# EAGLE schematic address_decoder_v1 (EAGLE 9.3.1)
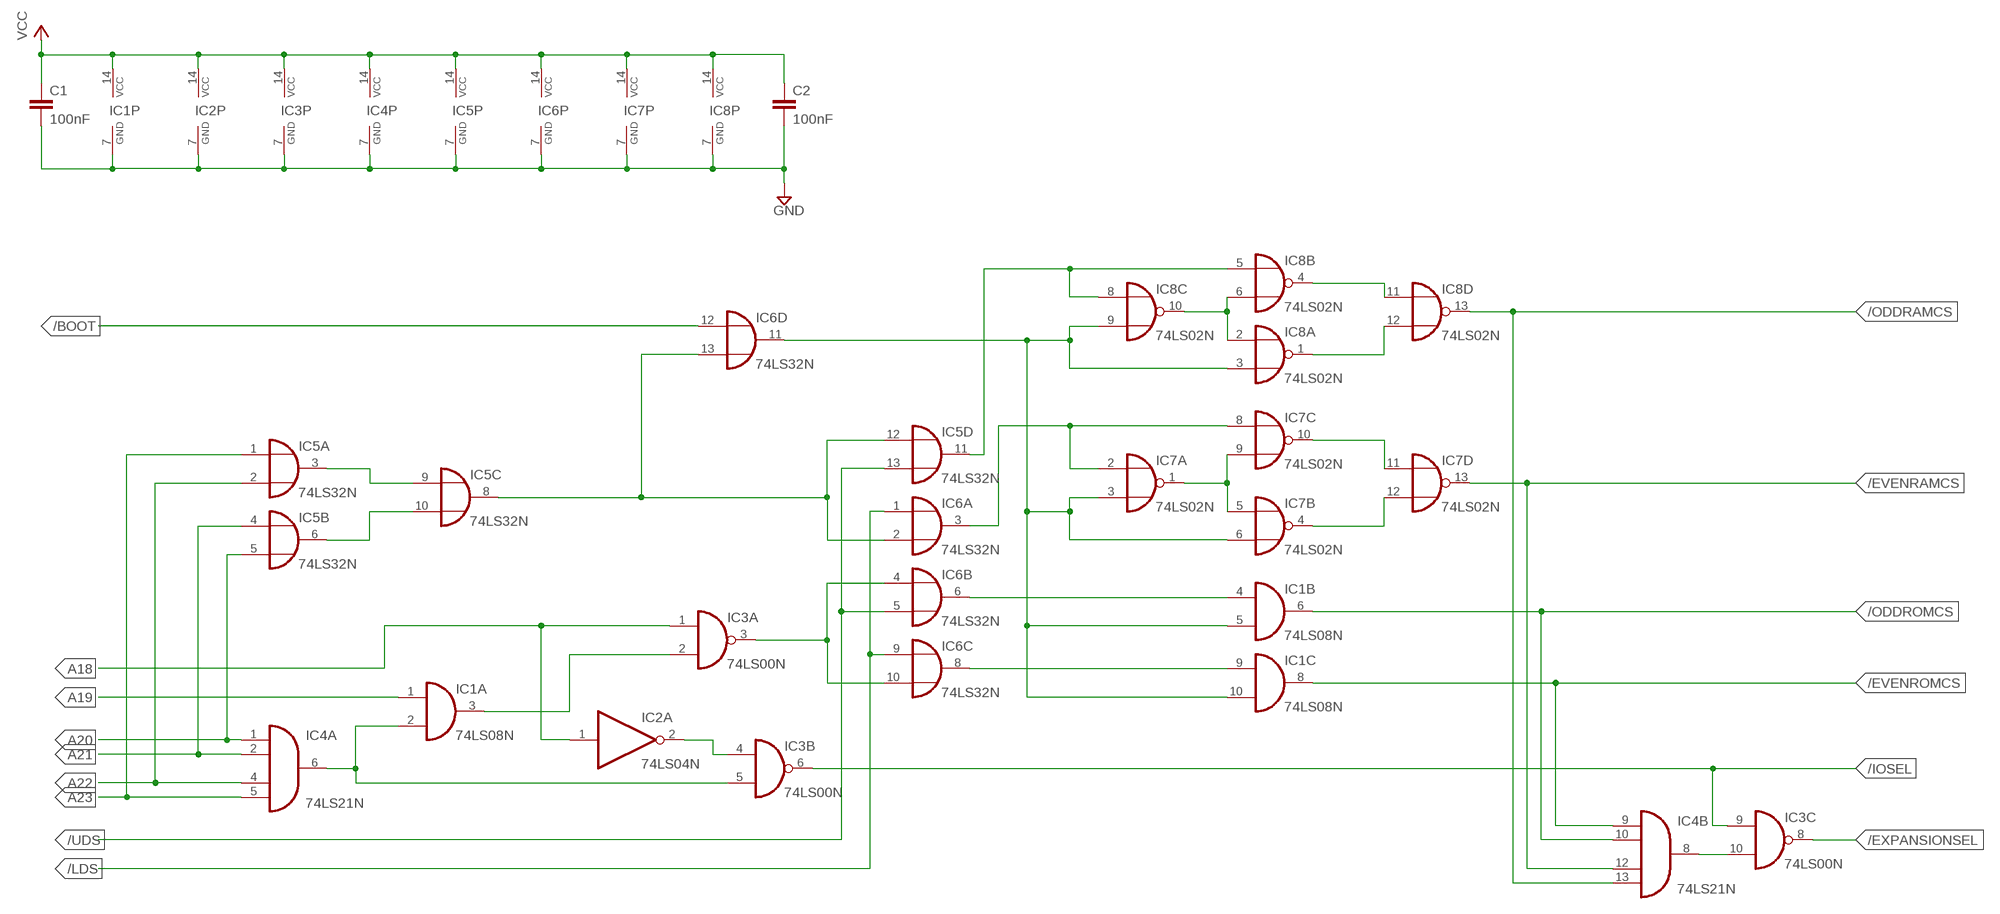
[diagram p0: schematic, sheet 1]

## Parts
C1  100nF  C-EU025-024X044  [C025-024X044]
C2  100nF  C-EU025-024X044  [C025-024X044]
IC1  74LS08N  [DIL14]
IC2  74LS04N  [DIL14]
IC3  74LS00N  [DIL14]
IC4  74LS21N  [DIL14]
IC5  74LS32N  [DIL14]
IC6  74LS32N  [DIL14]
IC7  74LS02N  [DIL14]
IC8  74LS02N  [DIL14]

## Nets
/BOOT: IC6.12(D:I0)
/EVENRAMCS: IC4.12(B:I2) IC7.13(D:O)
/EVENROMCS: IC1.8(C:O) IC4.9(B:I0)
/EXPANSIONSEL: IC3.8(C:O)
/IOSEL: IC3.6(B:O) IC3.9(C:I0)
/LDS: IC6.1(A:I0) IC6.9(C:I0)
/ODDRAMCS: IC4.13(B:I3) IC8.13(D:O)
/ODDROMCS: IC1.6(B:O) IC4.10(B:I1)
/UDS: IC5.13(D:I1) IC6.5(B:I1)
A18: IC2.1(A:I) IC3.1(A:I0)
A19: IC1.1(A:I0)
A20: IC4.1(A:I0) IC5.5(B:I1)
A21: IC4.2(A:I1) IC5.4(B:I0)
A22: IC4.4(A:I2) IC5.2(A:I1)
A23: IC4.5(A:I3) IC5.1(A:I0)
GND: C1.2 C2.2 IC1.7(P:GND) IC2.7(P:GND) IC3.7(P:GND) IC4.7(P:GND) IC5.7(P:GND) IC6.7(P:GND) IC7.7(P:GND) IC8.7(P:GND)
N$1: IC8.2(A:I0) IC8.6(B:I1) IC8.10(C:O)
N$2: IC8.4(B:O) IC8.11(D:I0)
N$3: IC8.1(A:O) IC8.12(D:I1)
N$4: IC5.11(D:O) IC8.5(B:I0) IC8.8(C:I0)
N$5: IC3.10(C:I1) IC4.8(B:O)
N$6: IC7.1(A:O) IC7.5(B:I0) IC7.9(C:I1)
N$7: IC7.10(C:O) IC7.11(D:I0)
N$8: IC6.3(A:O) IC7.2(A:I0) IC7.8(C:I0)
N$9: IC1.5(B:I1) IC1.10(C:I1) IC6.11(D:O) IC7.3(A:I1) IC7.6(B:I1) IC8.3(A:I1) IC8.9(C:I1)
N$10: IC7.4(B:O) IC7.12(D:I1)
N$11: IC1.4(B:I0) IC6.6(B:O)
N$12: IC1.9(C:I0) IC6.8(C:O)
N$13: IC5.3(A:O) IC5.9(C:I0)
N$14: IC5.6(B:O) IC5.10(C:I1)
N$17: IC3.3(A:O) IC6.4(B:I0) IC6.10(C:I1)
N$18: IC1.2(A:I1) IC3.5(B:I1) IC4.6(A:O)
N$19: IC2.2(A:O) IC3.4(B:I0)
N$20: IC5.8(C:O) IC5.12(D:I0) IC6.2(A:I1) IC6.13(D:I1)
N$21: IC1.3(A:O) IC3.2(A:I1)
VCC: C1.1 C2.1 IC1.14(P:VCC) IC2.14(P:VCC) IC3.14(P:VCC) IC4.14(P:VCC) IC5.14(P:VCC) IC6.14(P:VCC) IC7.14(P:VCC) IC8.14(P:VCC)
Unconnected: IC1.11(D:O) IC1.12(D:I0) IC1.13(D:I1) IC2.3(B:I) IC2.4(B:O) IC2.5(C:I) IC2.6(C:O) IC2.8(D:O) IC2.9(D:I) IC2.10(E:O) IC2.11(E:I) IC2.12(F:O) IC2.13(F:I) IC3.11(D:O) IC3.12(D:I0) IC3.13(D:I1)

## Library data of the parts
C1 C2 = rcl:C-EU: CAPACITOR, European symbol; SPICEPREFIX: C
IC1 = 74xx-eu:74*08: Quad 2-input AND gate
IC2 = 74xx-eu:74*04: Hex INVERTER
IC3 = 74xx-eu:74*00: Quad 2-input NAND gate
IC4 = 74xx-eu:74*21: Dual 4-input AND gate
IC5 IC6 = 74xx-eu:74*32: Quad 2-input OR gate
IC7 IC8 = 74xx-eu:74*02: Quad 2-input NOR gate